# Altium project Esp32_project.PrjPcb
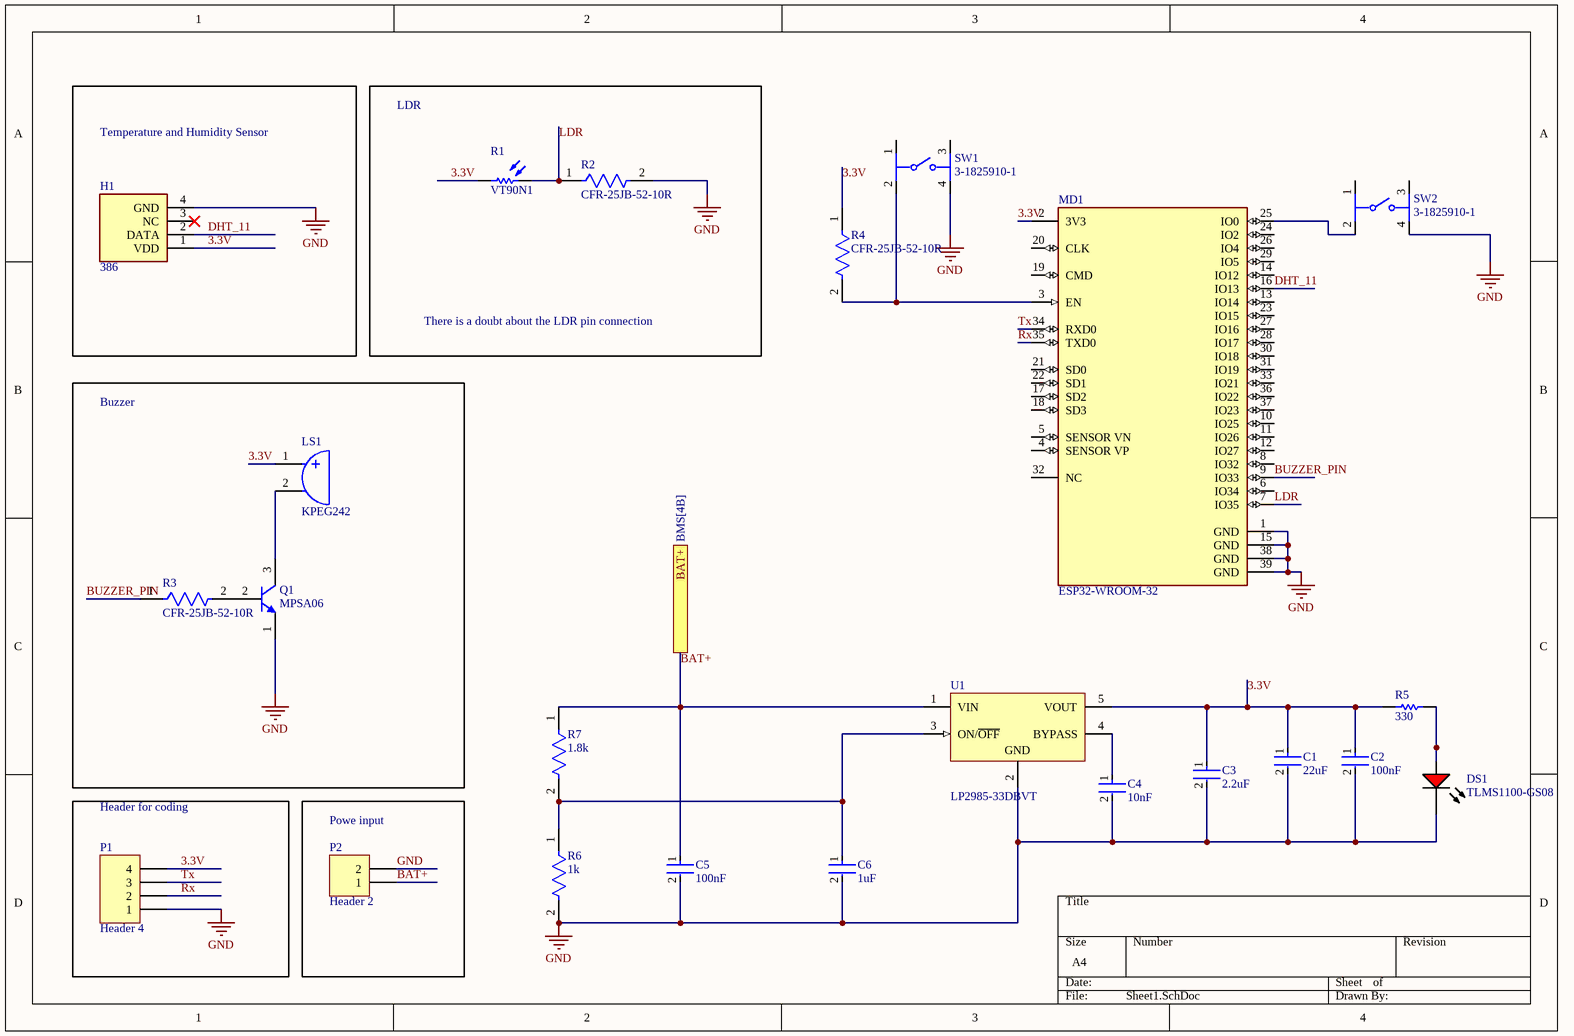
[diagram p0: Sheet1.SchDoc]
2 sheets, 32 parts. Net scope: flat (ports and power ports of the same name join across sheets).
Board file: PCB1.PcbDoc
Sheets:
  Sheet1.SchDoc
  BMS.SchDoc

## Sheet Sheet1.SchDoc
size A4; SheetNumber: 1; SheetTotal: 2

### Parts
C1  22uF  [FP-GCM188-0_1-IPC_A]
C2  100nF  [FP-GCM188-0_1-IPC_A]
C3  2.2uF  [FP-GCM188-0_1-IPC_A]
C4  10nF  [FP-GCM188-0_1-IPC_A]
C5  100nF  [FP-GCM188-0_1-IPC_A]
C6  1uF  [FP-GCM188-0_1-IPC_A]
DS1  TLMS1100-GS08  [VISH-TLMX1100_V]
H1  386  [386]
LS1  KPEG242  [KINGS-KPEG242-2]
MD1  ESP32-WROOM-32  [FP-ESP32-WROOM-32-MFG]
P1  Header 4  [HDR1X4]
P2  Header 2  [HDR1X2]
Q1  MPSA06  [ONSC-TO-92-3-29-11]
R1  VT90N1  [EXCE-VT90N1]
R2  CFR-25JB-52-10R  [FP-CFR-25-MFG]
R3  CFR-25JB-52-10R  [FP-CFR-25-MFG]
R4  CFR-25JB-52-10R  [FP-CFR-25-MFG]
R5  330  [RESC1608X55X25NL10T15]
R6  1k  [FP-RC0603-0_55-IPC_C]
R7  1.8k  [FP-RC0603-0_55-IPC_C]
SW1  3-1825910-1  [FP-3-1825910-1-MFG]
SW2  3-1825910-1  [FP-3-1825910-1-MFG]
U1  LP2985-33DBVT  [DBV0005A_L]

### Blocks framed on the sheet
Temperature and Humidity Sensor: H1
Buzzer: LS1 Q1 R3
Header for coding: P1
Powe input: P2

### Ports
BAT+ (see BMS[4B])

### Nets
GND: C1.2 C2.2 C3.2 C4.2 C5.2 C6.2 DS1.2(K) H1.4(GND) MD1.1(GND) MD1.15(GND) MD1.38(GND) MD1.39(GND) P1.1 P2.2 Q1.1(E) R2.2 R6.2 SW1.4 SW2.4 U1.2(GND)
3.3V: C1.1 C2.1 C3.1 H1.1(VDD) LS1.1 MD1.2(3V3) P1.4 R1.1 R4.1 R5.1 U1.5(VOUT)
BAT+: C5.1 P2.1 R7.1 U1.1(VIN) ; port BAT+
BUZZER_PIN: MD1.9(IO33) R3.1
DHT_11: H1.2(DATA) MD1.16(IO13)
LDR: MD1.7(IO35) R1.2 R2.1
Rx: MD1.35(TXD0) P1.2
Tx: MD1.34(RXD0) P1.3
NetC4_1: C4.1 U1.4(BYPASS)
NetC6_1: C6.1 R6.1 R7.2 U1.3(ON/~{OFF})
NetDS1_1: DS1.1(A) R5.2
NetLS1_2: LS1.2 Q1.3(C)
NetMD1_3: MD1.3(EN) R4.2 SW1.2
NetMD1_25: MD1.25(IO0) SW2.2
NetQ1_2: Q1.2(B) R3.2

Not connected (* = marked no-connect by the designer): H1 3(NC)*; MD1 4(SENSOR_VP) 5(SENSOR_VN) 6(IO34) 8(IO32) 10(IO25) 11(IO26) 12(IO27) 13(IO14) 14(IO12) 17(SD2) 18(SD3) 19(CMD) 20(CLK) 21(SD0) 22(SD1) 23(IO15) 24(IO2) 26(IO4) 27(IO16) 28(IO17) 29(IO5) 30(IO18) 31(IO19) 32(NC) 33(IO21) 36(IO22) 37(IO23); SW1 1 3; SW2 1 3

### Notes on the sheet
- LDR
- There is a doubt about the LDR pin connection

### Library data of the parts
C1-C6 = CMP-06035-025750-1: Ceramic Capacitor for Automotive 100nF  ±10% 25VDC X8R 0603 Paper T/R; Voltage Rating (DC): 25V; Capacitance: 100nF; Case/Package: 0603; Tolerance: 10%; Length: 1.6mm; Packaging: Tape and Reel; Depth: 0.8mm; Lead Free: Lead Free; Max Operating Temperature: 150°C; Dielectric: X8R; Min Operating Temperature: -55°C
DS1 = CMP-1666-00027-1: LED, RED, 2.1 V, -40 to 100 degC, 2-Pin SMD (0603), RoHS, Tape and Reel; Type (Capacitors): C0G; Resistance: 100000000000 Ohm; Capacitance: 12 pF; Voltage Rating: 50 V; Tolerance: 5%; Min Operating Temperature: -55degC; REACH SVHC: No SVHC; ComponentLink2Description: Datasheet; ComponentLink1URL: http://www.vishay.com/; Width: 0.8 mm; Package Quantity: 4000; PackageReference: TLMX1100; ComponentLink2URL: http://www.vishay.com/docs/83173/tlmb1100.pdf; Case/Package: 0603; Case Code (Metric): 1608; Packaging: Tape and Reel; Pins: 2; ComponentLink1Description: Manufacturer URL; Max Operating Temperature: 125degC; Height: 0.8 mm; Length: 1.6 mm; Mount: Surface Mount; PackageDescription: 2-Pin Surface Mount Device, Body 1.6 x 0.8 mm; DatasheetVersion: Rev. 2.7, 03/2016; Case Code (Imperial): 0603; Voltage Rating (DC): 50 V; RoHSCompliant: True; Radiation Hardening: No
H1 = 386: Hardware; Manufacturer_Name: Adafruit; Datasheet Link: https://datasheet.datasheetarchive.com/originals/distributors/DKDS-1/1982.pdf; Height: 15.5mm; Manufacturer_Part_Number: 386; Mouser Part Number: 485-386; Mouser Price/Stock: https://www.mouser.co.uk/ProductDetail/Adafruit/386?qs=GURawfaeGuDbeGFpZ2393w%3D%3D; Arrow Part Number: 386; Arrow Price/Stock: https://www.arrow.com/en/products/386/adafruit-industries?region=nac
LS1 = CMP-2000-06518-1: Piezo Indicator, 4100 Hz, 3 to 16 V, -20 to 70 degC, 2-Pin THD, RoHS; PartNumber: KPE-242; Manufacturer: KingstateElectronicsCorp.; Frequency Range: 3600to4600Hz; Maximum Supply Current: 7mA; Typical Operating Supply Voltage: 12Vdc; Product Height: 7.6mm; Current - Max: 7A; Tone Mode: Continuous; Product Diameter: 13.7mm; Minimum Sound Pressure: 70dBA; Maximum Resonant Frequency: 4600Hz; Type: Indicator; Datasheet URL: https://datasheet.ciiva.com/11776/0900766b8068f3a2-11776713.pdf; Mounting: ThroughHole; Technology: Piezo; Operating Temperature: -20to70°C; Category: AudioIndicatorsandAlerts; Termination Method: Pin; Manufacturer URL: http://www.kingstate.com.tw/index.php/en/; Package Description: 2-Pin Through Hole Device, Body Dia 13.7 mm, Pitch 7.62 mm; Datasheet Version: 01/2006; Package Reference: KPEG242; Mounting Technology: ThroughHole
MD1 = CMP-194065-000008-1: RX TXRX MOD WIFI SURFACE MOUNT; Frequency: 2.5GHz; Sensitivity: -98dBm; Operating Supply Voltage: 3.6V; Data Rate: 150Mbps; Weight: 0.088185oz; Package Quantity: 550; Min Operating Temperature: -40°C; Mount: Surface Mount; Max Operating Temperature: 85°C; Packaging: Cut Tape; Case/Package: SMD/SMT
P1 = Header 4: Header, 4-Pin; LatestRevisionDate: 17-Jul-2002; LatestRevisionNote: Re-released for DXP Platform.; Publisher: Altium Limited
P2 = Header 2: Header, 2-Pin; LatestRevisionDate: 17-Jul-2002; LatestRevisionNote: Re-released for DXP Platform.; Publisher: Altium Limited
Q1 = CMP-1048-01429-1: Amplifier Transistor, 3-Pin TO-92, Bulk Box; Manufacturer: On Semiconductor; Polarity: NPN; Note1: 0; fT Min (MHz): 100; IC Continuous (A): 0.5; ComponentLink1URL: http://www.onsemi.com/; ComponentLink3Description: Package Specification; PackageReference: TO-92-3-29-11_AM_SL; PackageDescription: 3-Pin Transistor Outline, Body 4.825 x 3.685 mm, Pitch 1.27 mm; ComponentLink3URL: http://www.onsemi.cn/pub_link/Collateral/2N6426-D.PDF; PartNumber: MPSA06; PackageVersion: Rev. AM; DatasheetVersion: Rev. 3; ComponentLink1Description: Manufacturer URL; ComponentLink2Description: Datasheet; ComponentLink2URL: http://www.onsemi.cn/pub_link/Collateral/MPSA05-D.PDF; Mounting Technology: Through Hole; Packing: Bulk Box; RoHS: FALSE
R1 = CMP-2000-07406-1: Photoconductive Resistor, 200 kOhm, 100 V, 80 mW, -40 to 75 degC, 2-Pin THD, RoHS; Manufacturer: Excelitas Technology; SVHC: Cadmiumchloride(15-Jun-2015); Power Rating: 80mW; Resistance @ Lux: 12kohm; Voltage Rating: 100V; Product Range: -; Datasheet Version: 09/2006; Resistor Case Style: -; Operating Temperature Max: 75°C; Package Reference: VT90N1; Datasheet URL: http://datasheet.octopart.com/VT90N1-Excelitas-datasheet-10388451.pdf; Mounting Technology: ThroughHole; Operating Temperature Min: -40°C; Dark Resistance: 200kohm; Package Description: 2-Pin Through Hole Device, Body Width 4.17 mm (Max), Height 2.29 mm; Manufacturer URL: http://www.excelitas.com/Pages/Index.aspx; Packaging: Each
R2-R4 = CMP-03413-000009-1: RES 10 OHM 1/4W 5% AXIAL; Resistance: 10R; Temperature Coefficient: 500ppm/°C; Max Power Dissipation: 250mW; RoHS Compliant: Yes; Packaging: Bulk; Series: Carbon Film; Case/Package: Axial; Max Operating Temperature: 155°C; Min Operating Temperature: -55°C; Number of Terminations: 2; Length: 0.248inch; Resistor Type: Carbon Film; Tolerance: 5%; Package Quantity: 200
R5 = CMP-1659-00020-2: Chip Resistor, 330 Ohm, +/- 1%, 0.1 W, -55 to 155 degC, 0603 (1608 Metric), RoHS, Tape and Reel; Tolerance: 10%; ESR: 800 mohm; Voltage Rating (DC): 16 V; Capacitance: 47 uF; Length: 7.3 mm; ComponentLink1URL: http://www.yageo.com/; Packaging: Tape and Reel; Pins: 2; ComponentLink1Description: Manufacturer URL; Case Code (Imperial): 2917; REACH SVHC: No SVHC; Width: 4.3 mm; ComponentLink2Description: Datasheet; Voltage Rating: 16 V; RoHSCompliant: True; Max Operating Temperature: 125degC; ComponentLink2URL: http://www.yageo.com/documents/recent/PYu-RC_Group_51_RoHS_L_04.pdf; Min Operating Temperature: -55degC; Case/Package: 2917; Radiation Hardening: No; DatasheetVersion: Rev. 4, 02/2016; Mount: Surface Mount; PackageReference: 0603; Package Quantity: 500; Case Code (Metric): 7343; PackageDescription: 2-Pin Surface Mount Device, Body 1.6 x 0.8 mm; Height: 3.1 mm
R6 R7 = CMP-2000-06931-2: RES SMD 1.8K OHM 1% 1/10W 0603; Power Rating: 100mW; Voltage Rating (DC): 50V; Temperature Coefficient: 100ppm/°C; Resistance: 1.8kR; REACH SVHC: No SVHC; Construction: Rectangular; Resistance Tolerance: 1%; Package Quantity: 5000; Tolerance: 1%; Min Operating Temperature: -55°C; Case Code (Metric): 1608; Number of Terminations: 2; Case/Package: 0603; Number of Pins: 2; Max Power Dissipation: 100mW; Max Operating Temperature: 155°C; Technology: THICK FILM; Resistor Type: Thick Film; Voltage Rating: 50V; Depth: 0.8mm; Size Code: 0603; Width: 0.8mm; Features: Moisture Resistant; Lead Free: Lead Free; Height: 0.45mm; RoHS Compliant: Yes; Termination: SMD/SMT; Military Standard: Not; Case Code (Imperial): 0603; Packaging: Tape and Reel; Series: RC; Length: 1.6mm
SW1 SW2 = CMP-03407-000001-1: SWITCH TACTILE SPST-NO 0.05A 24V; Manufacturer: TE Connectivity; Operating Force: 160gf; Contact Current Rating: 50mA; Contact Resistance: 100mΩ; Electromechanical Life: 100000Cycles; Device Class L1: Electromechanical; ComponentLink2URL: https://www.te.com/commerce/DocumentDelivery/DDEController?Action=srchrtrv&DocNm=1825910&DocType=Customer+Drawing&DocLang=English; Category: Switch; Device Class L2: Switches; Temperature: -35°C to +85°C; RoHS: TRUE; Mount: Through Hole; Manufacturer Part Number: 3-1825910-1; Automotive: No; Lead Free: Yes; Device Class L3: Tactile Switches; ComponentLink2Description: Datasheet; Temperature Range High: +85°C; Height: 17.3mm; Package: 0; Temperature Range Low: -35°C; Throw Configuration: SPST-NO; Digikey Description: SWITCH TACTILE SPST-NO 0.05A 24V; Octopart: https://octopart.com/3-1825910-1-te+connectivity-46506874
U1 = CMP-0758-00030-2: Single Output Low Noise LDO, 150 mA, Fixed 3.3 V Output, 1.5% Tolerance, 2.2 to 16 V Input, Low IQ, 5-Pin SOT-23 (DBV), -40 to 125 degC, Green (RoHS & no Sb/Br), Tape and Reel; Manufacturer: Texas Instruments; Iq (Typ) (mA): 0.85; Fixed Output Options (V): 3.3; Iout (Max) (A): 0.15; Accuracy (%): 1.5; Vdo (Typ) (mV): 280; Output Options: Fixed Output; RoHS: TRUE; Vin (V): 2.2 to 16; PartNumber: LP2985-33DBVT; Mounting Technology: Surface Mount; Packing: Tape and Reel; ComponentLink1Description: Manufacturer URL; ComponentLink3URL: http://www.ti.com/litv/pdf/mpds018j; ComponentLink3Description: Package Specification; PackageDescription: 5-Pin Plastic Small Outline, Body 2.9 x 1.6 mm, Pitch 0.95 mm; PackageReference: DBV0005A; ComponentLink2Description: Datasheet; ComponentLink1URL: http://www.ti.com/; Operating Temperature Range (degC): -40 to 125; PackageVersion: 4073253-4/L; DatasheetVersion: SLVS522N; ComponentLink2URL: http://www.ti.com/lit/ds/symlink/lp2985-50.pdf

## Sheet BMS.SchDoc
size A4; SheetNumber: 2; SheetTotal: 2
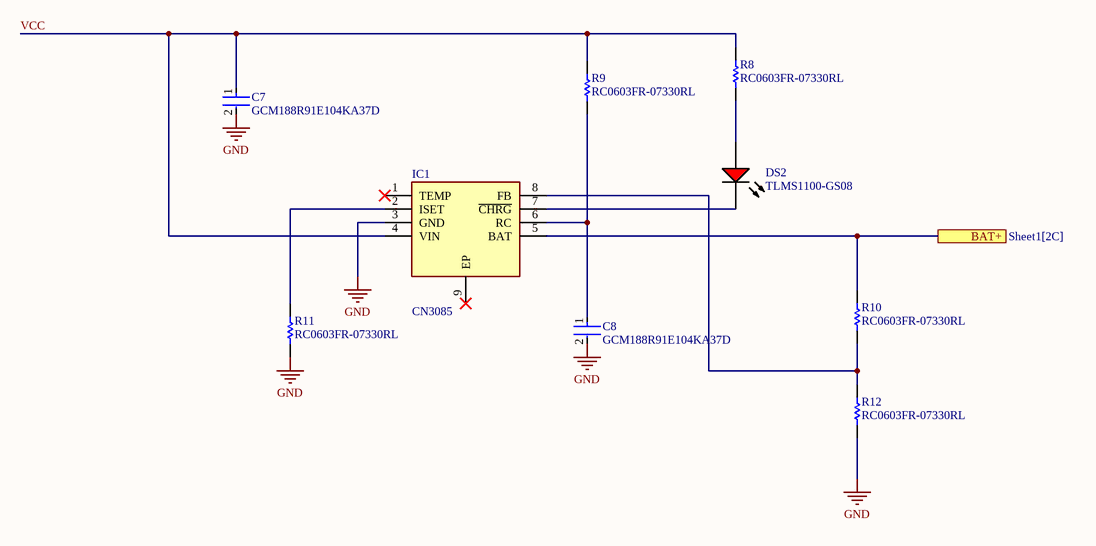
[diagram p1: BMS.SchDoc]

### Parts
C7  GCM188R91E104KA37D  [FP-GCM188-0_1-IPC_A]
C8  GCM188R91E104KA37D  [FP-GCM188-0_1-IPC_A]
DS2  TLMS1100-GS08  [VISH-TLMX1100_V]
IC1  CN3085  [SOIC127P600X175-9N]
R8  RC0603FR-07330RL  [RESC1608X55X25ML10T15]
R9  RC0603FR-07330RL  [RESC1608X55X25ML10T15]
R10  RC0603FR-07330RL  [RESC1608X55X25ML10T15]
R11  RC0603FR-07330RL  [RESC1608X55X25ML10T15]
R12  RC0603FR-07330RL  [RESC1608X55X25ML10T15]

### Ports
BAT+ (see Sheet1[2C])

### Nets
GND: C7.2 C8.2 IC1.3(GND) R11.2 R12.2
BAT+: IC1.5(BAT) R10.1 ; port BAT+
VCC: C7.1 IC1.4(VIN) R8.1 R9.1
NetC8_1: C8.1 IC1.6(RC) R9.2
NetDS2_1: DS2.1(A) R8.2
NetDS2_2: DS2.2(K) IC1.7(~{CHRG})
NetIC1_2: IC1.2(ISET) R11.1
NetIC1_8: IC1.8(FB) R10.2 R12.1

Not connected (* = marked no-connect by the designer): IC1 1(TEMP)* 9(EP)*

### Library data of the parts
C7 C8 = CMP-06035-025750-1: as C1 on sheet Sheet1; Capacitance: 100nF; Case/Package: 0603; Tolerance: 10%; Length: 1.6mm; Packaging: Tape and Reel; Depth: 0.8mm; Lead Free: Lead Free; Max Operating Temperature: 150°C; Dielectric: X8R; Min Operating Temperature: -55°C
DS2 = CMP-1666-00027-1: as DS1 on sheet Sheet1; Min Operating Temperature: -55degC; REACH SVHC: No SVHC; ComponentLink2Description: Datasheet; ComponentLink1URL: http://www.vishay.com/; Width: 0.8 mm; Package Quantity: 4000; PackageReference: TLMX1100; ComponentLink2URL: http://www.vishay.com/docs/83173/tlmb1100.pdf; Case/Package: 0603; Case Code (Metric): 1608; Packaging: Tape and Reel; Pins: 2; ComponentLink1Description: Manufacturer URL; Max Operating Temperature: 125degC; Height: 0.8 mm; Length: 1.6 mm; Mount: Surface Mount; PackageDescription: 2-Pin Surface Mount Device, Body 1.6 x 0.8 mm; DatasheetVersion: Rev. 2.7, 03/2016; Case Code (Imperial): 0603; Voltage Rating (DC): 50 V; RoHSCompliant: True; Radiation Hardening: No
IC1 = CN3085: Integrated Circuit; Manufacturer_Name: Consonance; Datasheet Link: http://www.consonance-elec.com/pdf/datasheet/DSE-CN3085.pdf; Height: 1.75mm; Manufacturer_Part_Number: CN3085
R8-R12 = CMP-1659-00020-2: as R5 on sheet Sheet1; Length: 7.3 mm; ComponentLink1URL: http://www.yageo.com/; Packaging: Tape and Reel; Pins: 2; ComponentLink1Description: Manufacturer URL; Case Code (Imperial): 2917; REACH SVHC: No SVHC; Width: 4.3 mm; ComponentLink2Description: Datasheet; Voltage Rating: 16 V; RoHSCompliant: True; Max Operating Temperature: 125degC; ComponentLink2URL: http://www.yageo.com/documents/recent/PYu-RC_Group_51_RoHS_L_04.pdf; Min Operating Temperature: -55degC; Case/Package: 2917; Radiation Hardening: No; DatasheetVersion: Rev. 4, 02/2016; Mount: Surface Mount; PackageReference: 0603; Package Quantity: 500; Case Code (Metric): 7343; PackageDescription: 2-Pin Surface Mount Device, Body 1.6 x 0.8 mm; Height: 3.1 mm

## Nets that join several sheets
GND: Sheet1 (20 pins), BMS (5 pins)
BAT+: Sheet1 (C5.1 P2.1 R7.1 U1.1), BMS (IC1.5 R10.1)